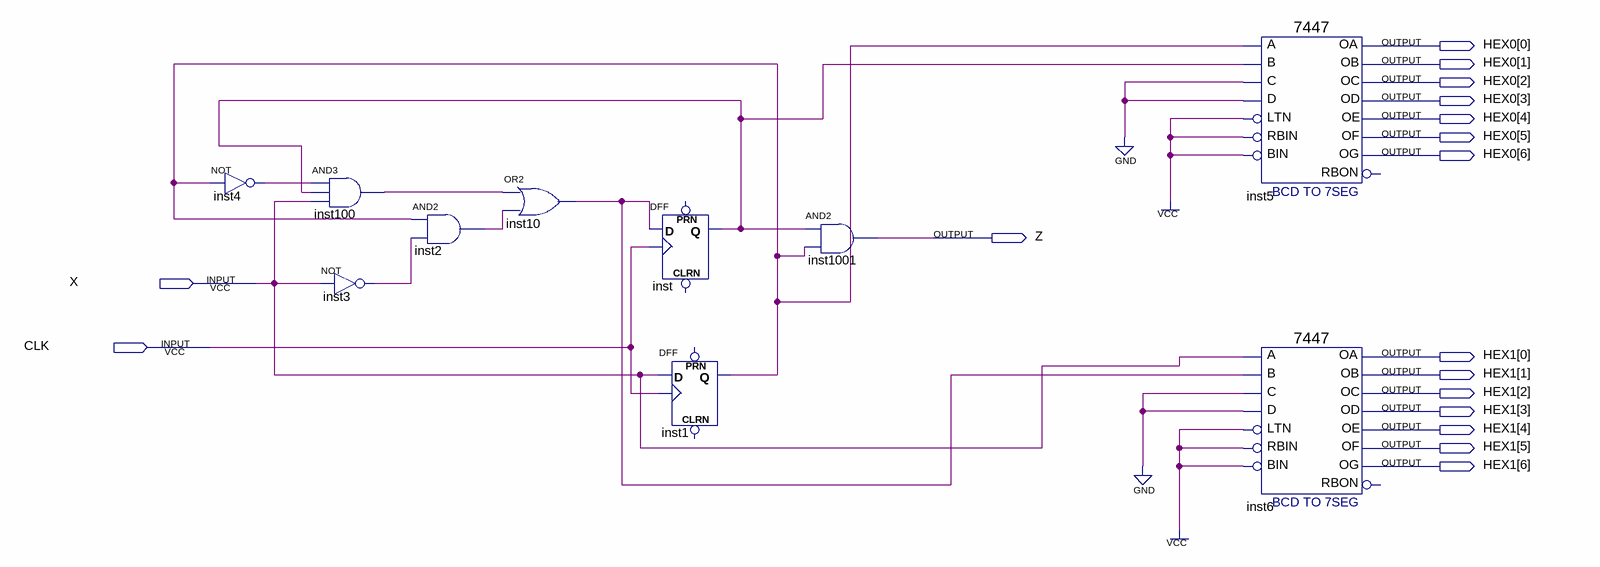
[diagram p0: schematic sheet]
// Quartus schematic moore.bdf as structural Verilog: 10 symbols, 17 pins
module moore (
  input  X,
  input  CLK,
  output [6:0] HEX0,
  output Z,
  output [6:0] HEX1
);

  wire inst1_q, inst2_out, inst3_out, inst4_out, inst10_out, inst100_out, inst_q;

  not inst4 (inst4_out, inst1_q);
  and inst100 (inst100_out, inst4_out, inst_q, X);
  not inst3 (inst3_out, X);
  and inst2 (inst2_out, inst1_q, inst3_out);
  or inst10 (inst10_out, inst100_out, inst2_out);
  DFF inst (.CLK(CLK), .D(inst10_out), .Q(inst_q));  // open: CLRN, PRN
  DFF inst1 (.CLK(CLK), .D(X), .Q(inst1_q));  // open: CLRN, PRN
  and inst1001 (Z, inst_q, inst1_q);
  \7447  inst5 (
    .LTN(1'b1), .B(inst_q), .C(1'b0), .D(1'b0), .RBIN(1'b1), .BIN(1'b1), .A(inst1_q), .OB(HEX0[1]),
    .OC(HEX0[2]), .OE(HEX0[4]), .OD(HEX0[3]), .OF(HEX0[5]), .OG(HEX0[6]), .OA(HEX0[0]));  // open: RBON
  \7447  inst6 (
    .LTN(1'b1), .B(inst10_out), .C(1'b0), .D(1'b0), .RBIN(1'b1), .BIN(1'b1), .A(X), .OB(HEX1[1]),
    .OC(HEX1[2]), .OE(HEX1[4]), .OD(HEX1[3]), .OF(HEX1[5]), .OG(HEX1[6]), .OA(HEX1[0]));  // open: RBON
endmodule
